# Altium schematic sheet UartCircuit.SchDoc
size A; SheetNumber: 4; SheetTotal: 8
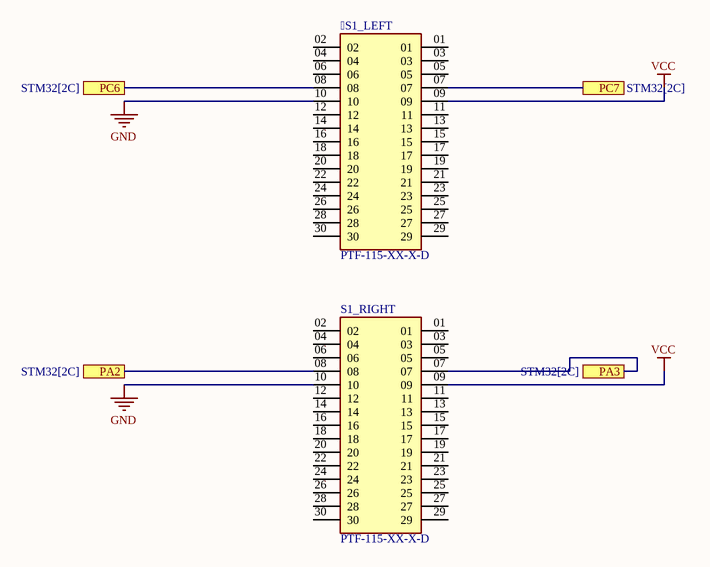
[diagram p0: UartCircuit.SchDoc]

## Parts
S1_LEFT  PTF-115-XX-X-D  [SAMTEC_PTF-115-XX-X-D]
S1_RIGHT  PTF-115-XX-X-D  [SAMTEC_PTF-115-XX-X-D]

## Ports
PA2 (see STM32[2C]), PA3 (see STM32[2C]), PC6 (see STM32[2C]), PC7 (see STM32[2C])

## Nets
GND: S1_LEFT.10 S1_RIGHT.10
VCC: S1_LEFT.09 S1_RIGHT.09
PA2: S1_RIGHT.08 ; port PA2
PA3: S1_RIGHT.07 ; port PA3
PC6: S1_LEFT.08 ; port PC6
PC7: S1_LEFT.07 ; port PC7

Not connected (* = marked no-connect by the designer): S1_LEFT 01 02 03 04 05 06 11 12 13 14 15 16 17 18 19 20 21 22 23 24 25 26 27 28 29 30; S1_RIGHT 01 02 03 04 05 06 11 12 13 14 15 16 17 18 19 20 21 22 23 24 25 26 27 28 29 30

## Library data of the parts
S1_LEFT S1_RIGHT = PTF-115-XX-X-D: Headers & Wire Housings 2.00 mm Press-Fit Socket Strip; MF: Samtec; Package: None; Price: None; Value: *; MP: PTF-115-XX-X-D; Availability: Unavailable